# EAGLE design lednode2 (EAGLE 6.5.0)
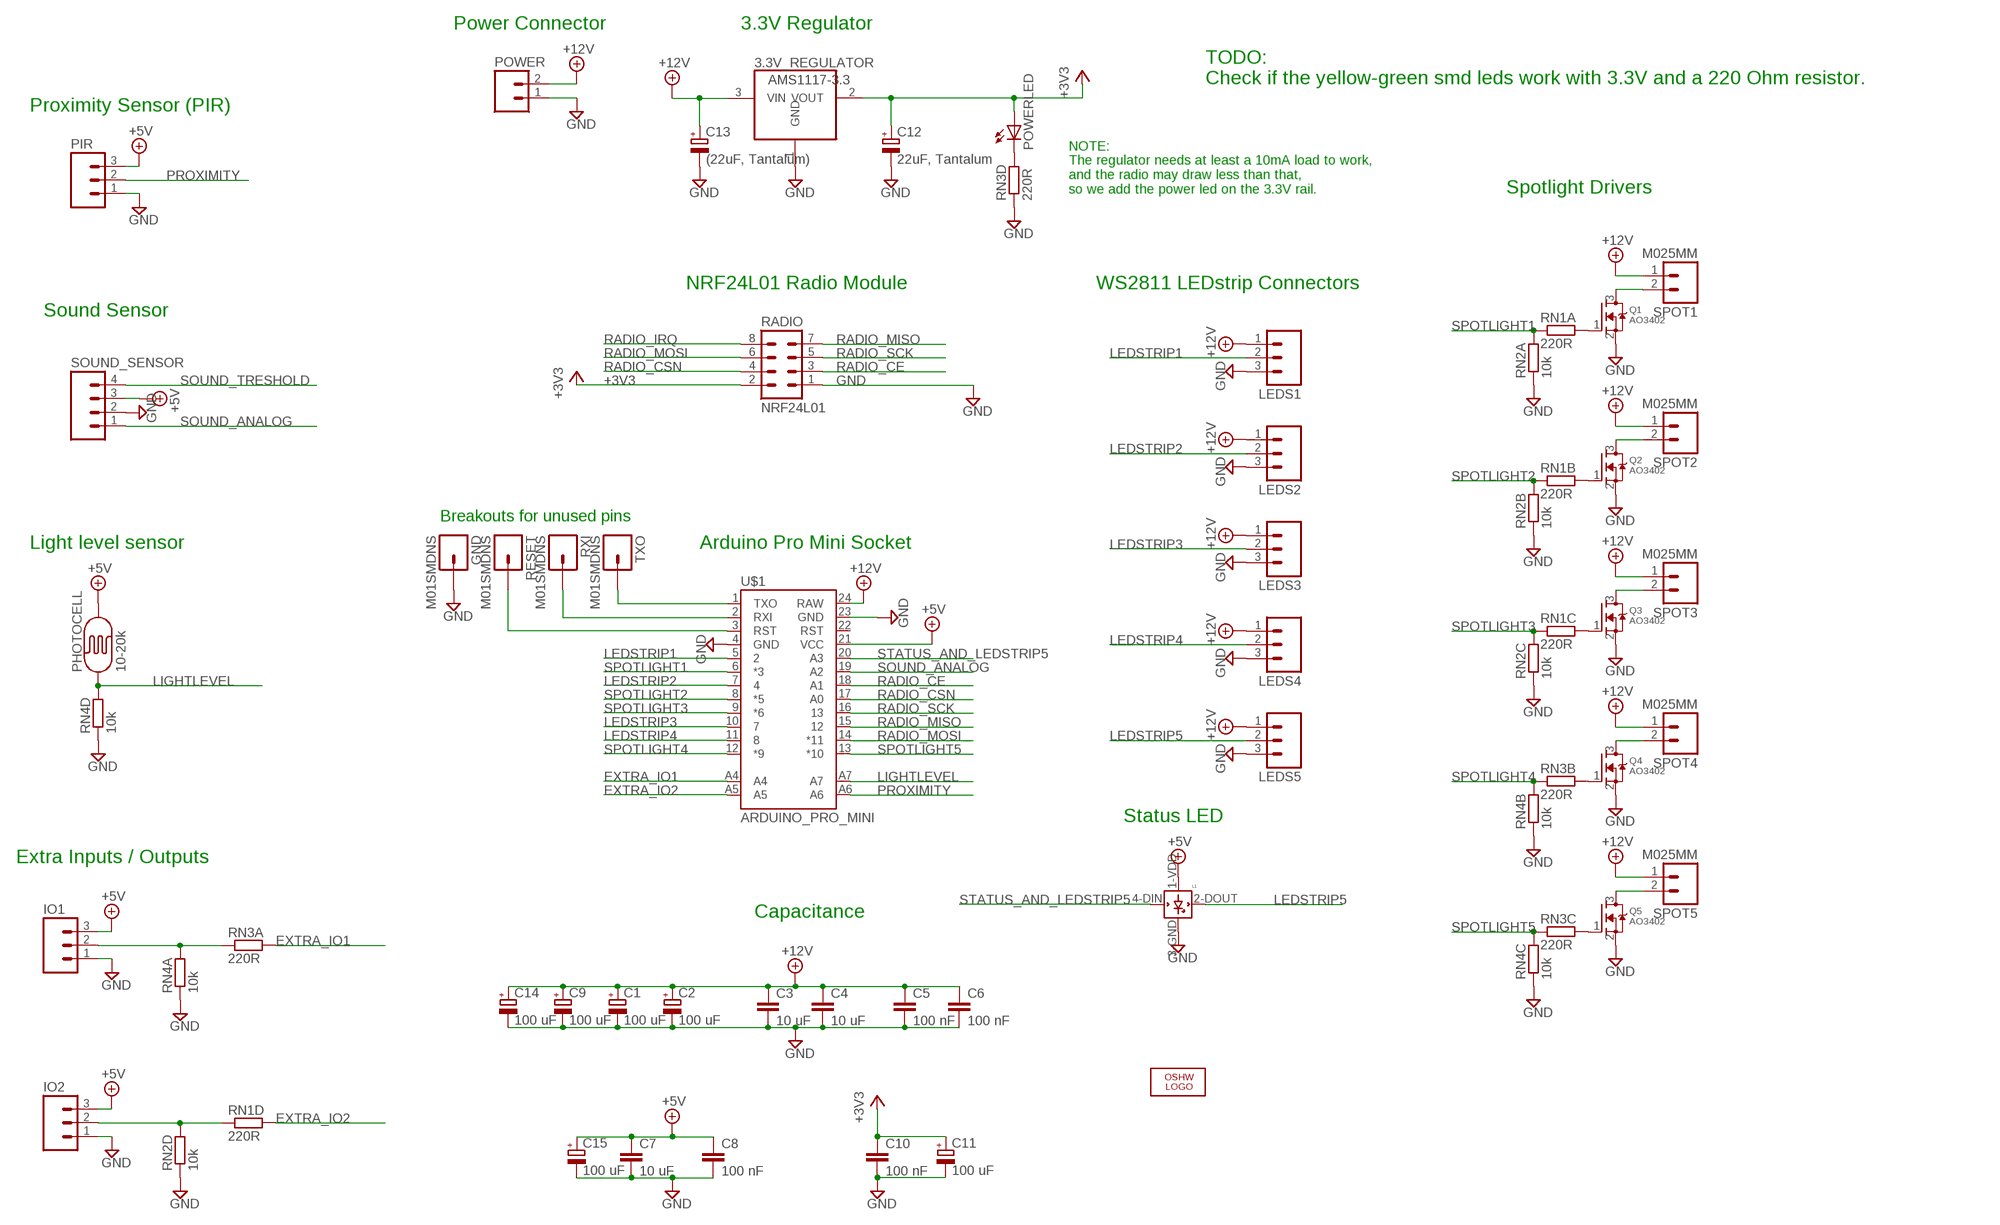
[diagram p0: schematic, sheet 1]

## Parts
3.3V_REGULATOR  AMS1117-3.3  REG1117  [SOT223]
C1  100 uF  CPOL-EUE2.5-6  [E2,5-6]
C2  100 uF  CPOL-EUE2.5-6  [E2,5-6]
C3  10 uF  C-EUC1206  [C1206]
C4  10 uF  C-EUC1206  [C1206]
C5  100 nF  C-EUC0805  [C0805]
C6  100 nF  C-EUC0805  [C0805]
C7  10 uF  C-EUC1206  [C1206]
C8  100 nF  C-EUC0805  [C0805]
C9  100 uF  CPOL-EUE2.5-6  [E2,5-6]
C10  100 nF  C-EUC0805  [C0805]
C11  100 uF  CPOL-EUE2.5-6  [E2,5-6]
C12  22uF, Tantalum  CPOL-EUSMCA  [SMC_A]
C13  (22uF, Tantalum)  CPOL-EUSMCA  [SMC_A]
C14  100 uF  CPOL-EUE2.5-6  [E2,5-6]
C15  100 uF  CPOL-EUE2.5-6  [E2,5-6]
GND  M01SMDNS  [1X01NS]
IO1  M03PTH  [1X03]
IO2  M03PTH  [1X03]
L1  WS2812B  [WS2812B]
LEDS1  M03LONGPADS  [1X03_LONGPADS]
LEDS2  M03LONGPADS  [1X03_LONGPADS]
LEDS3  M03LONGPADS  [1X03_LONGPADS]
LEDS4  M03LONGPADS  [1X03_LONGPADS]
LEDS5  M03LONGPADS  [1X03_LONGPADS]
LOGO3  LOGO-OSHW-8MILX0100-NT  [OSHW_8X100_NOTEXT]
PHOTOCELL  10-20k  PHOTOCELLPTH  [PHOTOCELL]
PIR  M03PTH  [1X03]
POWER  M025MM  [SCREWTERMINAL-5MM-2]
POWERLED  LEDSMT1206  [1206]
Q1  AO3402  MOSFET-NWAVE  [SOT23-W]
Q2  AO3402  MOSFET-NWAVE  [SOT23-W]
Q3  AO3402  MOSFET-NWAVE  [SOT23-W]
Q4  AO3402  MOSFET-NWAVE  [SOT23-W]
Q5  AO3402  MOSFET-NWAVE  [SOT23-W]
RADIO  NRF24L01  MA04-2  [MA04-2]
RESET  M01SMDNS  [1X01NS]
RN1  220R  RESISTOR_ARRAY_4  [RN8P-4R-CRA06S]
RN2  10k  RESISTOR_ARRAY_4  [RN8P-4R-CRA06S]
RN3  220R  RESISTOR_ARRAY_4  [RN8P-4R-CRA06S]
RN4  10k  RESISTOR_ARRAY_4  [RN8P-4R-CRA06S]
RXI  M01SMDNS  [1X01NS]
SOUND_SENSOR  M041X04_NO_SILK  [1X04_NO_SILK]
SPOT1  M025MM  [SCREWTERMINAL-5MM-2]
SPOT2  M025MM  [SCREWTERMINAL-5MM-2]
SPOT3  M025MM  [SCREWTERMINAL-5MM-2]
SPOT4  M025MM  [SCREWTERMINAL-5MM-2]
SPOT5  M025MM  [SCREWTERMINAL-5MM-2]
TXO  M01SMDNS  [1X01NS]
U$1  ARDUINO_PRO_MINI  [ARDUINO_PRO_MINI]

## Nets
+3V3: 3.3V_REGULATOR.2(VOUT) C10.1 C11.+ C12.+ POWERLED.A RADIO.2
+5V: C7.1 C8.1 C15.+ IO1.3 IO2.3 L1.1-VDD(VDD) PHOTOCELL.2 PIR.3 SOUND_SENSOR.3 U$1.21(VCC)
+12V: 3.3V_REGULATOR.3(VIN) C1.+ C2.+ C3.1 C4.1 C5.1 C6.1 C9.+ C13.+ C14.+ LEDS1.1 LEDS2.1 LEDS3.1 LEDS4.1 LEDS5.1 POWER.2 SPOT1.1 SPOT2.1 SPOT3.1 SPOT4.1 SPOT5.1 U$1.24(RAW)
EXTRA_IO1: RN3.8 U$1.A4
EXTRA_IO2: RN1.5 U$1.A5
GND: 3.3V_REGULATOR.1(GND) C1.- C2.- C3.2 C4.2 C5.2 C6.2 C7.2 C8.2 C9.- C10.2 C11.- C12.- C13.- C14.- C15.- GND.1 IO1.1 IO2.1 L1.3-GND(GND) LEDS1.3 LEDS2.3 LEDS3.3 LEDS4.3 LEDS5.3 PIR.1 POWER.1 Q1.2(S) Q2.2(S) Q3.2(S) Q4.2(S) Q5.2(S) RADIO.1 RN2.1 RN2.2 RN2.3 RN2.4 RN3.4 RN4.1 RN4.2 RN4.3 RN4.4 SOUND_SENSOR.2 U$1.4(GND) U$1.23(GND)
LEDSTRIP1: LEDS1.2 U$1.5
LEDSTRIP2: LEDS2.2 U$1.7
LEDSTRIP3: LEDS3.2 U$1.10
LEDSTRIP4: LEDS4.2 U$1.11
LEDSTRIP5: L1.2-DOUT(DOUT) LEDS5.2
LIGHTLEVEL: PHOTOCELL.1 RN4.5 U$1.A7
N$1: Q5.3(D) SPOT5.2
N$2: Q1.3(D) SPOT1.2
N$3: Q2.3(D) SPOT2.2
N$4: Q4.3(D) SPOT4.2
N$5: Q3.3(D) SPOT3.2
N$6: Q1.1(G) RN1.8
N$7: Q2.1(G) RN1.7
N$8: Q4.1(G) RN3.7
N$9: Q3.1(G) RN1.6
N$10: Q5.1(G) RN3.6
N$11: POWERLED.C RN3.5
N$13: IO2.2 RN1.4 RN2.5
N$14: TXO.1 U$1.1(TXO)
N$15: RXI.1 U$1.2(RXI)
N$16: RESET.1 U$1.3(RST)
PROXIMITY: PIR.2 U$1.A6
RADIO_CE: RADIO.3 U$1.18(A1)
RADIO_CSN: RADIO.4 U$1.17(A0)
RADIO_IRQ: RADIO.8
RADIO_MISO: RADIO.7 U$1.15
RADIO_MOSI: RADIO.6 U$1.14(*11)
RADIO_SCK: RADIO.5 U$1.16
SENSOR1: IO1.2 RN3.1 RN4.8
SOUND_ANALOG: SOUND_SENSOR.1 U$1.19(A2)
SOUND_TRESHOLD: SOUND_SENSOR.4
SPOTLIGHT1: RN1.1 RN2.8 U$1.6(*3)
SPOTLIGHT2: RN1.2 RN2.7 U$1.8(*5)
SPOTLIGHT3: RN1.3 RN2.6 U$1.9(*6)
SPOTLIGHT4: RN3.2 RN4.7 U$1.12(*9)
SPOTLIGHT5: RN3.3 RN4.6 U$1.13(*10)
STATUS_AND_LEDSTRIP5: L1.4-DIN(DIN) U$1.20(A3)
Unconnected: U$1.22(RST)

## Notes on the sheet
- Power Connector | 3.3V Regulator
- TODO:
  Check if the yellow-green smd leds work with 3.3V and a 220 Ohm resistor.
- Proximity Sensor (PIR)
- NOTE:
  The regulator needs at least a 10mA load to work, 
  and the radio may draw less than that, 
  so we add the power led on the 3.3V rail.
- Spotlight Drivers
- NRF24L01 Radio Module | WS2811 LEDstrip Connectors
- Sound Sensor
- Breakouts for unused pins
- Light level sensor | Arduino Pro Mini Socket
- Status LED
- Extra Inputs / Outputs
- Capacitance

## Library data of the parts
3.3V_REGULATOR = burr-brown:REG1117: 800mA and 1A Low Dropout (LDO) Positive Regulator 1.8V, 2.5V, 2.85V, 3.3V, 5V, and Adj; MPN: REG1117; OC_FARNELL: 1097566; OC_NEWARK: 14P6981
C1 C2 C9 C11-C15 = rcl:CPOL-EU: POLARIZED CAPACITOR, European symbol
C3-C8 C10 = rcl:C-EU: CAPACITOR, European symbol
GND RESET RXI TXO = SparkFun-Connectors:M01: Header 1 Standard 1-pin 0.1" header. Use with straight break away headers (SKU : PRT-00116), right angle break away headers (PRT-00553), swiss pins (PRT-00743), machine pins (PRT-00117), and female headers (PRT-00115).
IO1 IO2 LEDS1-LEDS5 PIR = SparkFun-Connectors:M03: Header 3 Standard 3-pin 0.1" header. Use with straight break away headers (SKU : PRT-00116), right angle break away headers (PRT-00553), swiss pins (PRT-00743), machine pins (PRT-00117), and female headers (PRT-00115). Molex polarized connector foot print use with SKU : PRT-08232 with associated crimp pins and housings.
L1 = adafruit:WS2812B
LOGO3 = Logo:LOGO-OSHW-8MIL
PHOTOCELL = SparkFun-Sensors:PHOTOCELL: CdS photoresistor. This is a low cost way to detect light levels. Resistance decreases with more incoming light. SparkFun SKU: SEN-09088
POWER = SparkFun:M02: Header 2 Standard 2-pin 0.1" header. Use with straight break away headers (SKU : PRT-00116), right angle break away headers (PRT-00553), swiss pins (PRT-00743), machine pins (PRT-00117), and female headers (PRT-00115). Molex polarized connector foot print use with SKU : PRT-08233 with associated crimp pins and housings.
POWERLED = led:LED: LED OSRAM: - CHIPLED LG R971, LG N971, LY N971, LG Q971, LY Q971, LO R971, LY R971 LH N974, LH R974 LS Q976, LO Q976, LY Q976 LO Q996 - Hyper CHIPLED LW Q18S LB Q993, LB Q99A, LB R99A - SideLED LS A670, LO A670, LY A670, LG A670, LP A670 LB A673, LV A673, LT A673, LW A673 LH A674 LY A675 LS A676, LA A676, LO A676, LY A676, LW A676 LS A679, LY A679, LG A679 - Hyper Micro SIDELED® LS Y876, LA Y876, LO Y876, LY Y876 LT Y87S - SmartLED LW L88C, LW L88S LB L89C, LB L89S, LG L890 LS L89K, LO L89K, LY L89K LS L896, LA L896, LO L896, LY L896 - TOPLED LS T670, LO T670, LY T670, LG T670, LP T670 LSG T670, LSP T670, LSY T670, LOP T670, LYG T670 LG T671, LOG T671, LSG T671 LB T673, LV T673, LT T673, LW T673 LH T674 LS T676, LA T676, LO T676, LY T676, LB T676, LH T676, LSB T676, LW T676 LB T67C, LV T67C, LT T67C, LS T67K, LO T67K, LY T67K, LW E67C LS E67B, LA E67B, LO E67B, LY E67B, LB E67C, LV E67C, LT E67C LW T67C LS T679, LY T679, LG T679 LS T770, LO T770, LY T770, LG T770, LP T770 LB T773, LV T773, LT T773, LW T773 LH T774 LS E675, LA E675, LY E675, LS T675 LS T776, LA T776, LO T776, LY T776, LB T776 LHGB T686 LT T68C, LB T68C - Hyper Mini TOPLED® LB M676 - Mini TOPLED Santana® LG M470 LS M47K, LO M47K, LY M47K Source: http://www.osram.convergy.de LUXEON: - LUMILED® LXK2-PW12-R00, LXK2-PW12-S00, LXK2-PW14-U00, LXK2-PW14-V00 LXK2-PM12-R00, LXK2-PM12-S00, LXK2-PM14-U00 LXK2-PE12-Q00, LXK2-PE12-R00, LXK2-PE12-S00, LXK2-PE14-T00, LXK2-PE14-U00 LXK2-PB12-K00, LXK2-PB12-L00, LXK2-PB12-M00, LXK2-PB14-N00, LXK2-PB14-P00, LXK2-PB14-Q00 LXK2-PR12-L00, LXK2-PR12-M00, LXK2-PR14-Q00, LXK2-PR14-R00 LXK2-PD12-Q00, LXK2-PD12-R00, LXK2-PD12-S00 LXK2-PH12-R00, LXK2-PH12-S00 LXK2-PL12-P00, LXK2-PL12-Q00, LXK2-PL12-R00 Source: www.luxeon.com KINGBRIGHT: KA-3528ASYC Source: www.kingbright.com
Q1-Q5 = adafruit:MOSFET-N: N-Channel Mosfet 2N7002E - 60V 260mA SOT23 [Digikey: 2N7002ET1GOSTR-ND] - REEL BSH103 - 30V 850mA SOT23 [Digikey: 568-5013-1-ND]
RADIO = con-lstb:MA04-2: PIN HEADER; OC_FARNELL: unknown; OC_NEWARK: unknown
RN1-RN4 = dp_devices:RESISTOR_ARRAY_4: 4 Resistor Array 0603
SOUND_SENSOR = SparkFun-Connectors:M04: Header 4 Standard 4-pin 0.1" header. Use with straight break away headers (SKU : PRT-00116), right angle break away headers (PRT-00553), swiss pins (PRT-00743), machine pins (PRT-00117), and female headers (PRT-00115). Molex polarized connector foot print use with SKU : PRT-08231 with associated crimp pins and housings. 1MM SMD Version SKU: PRT-10208
SPOT1-SPOT5 = SparkFun-Connectors:M02: Standard 2-pin 0.1" header. Use with - straight break away headers ( PRT-00116) - right angle break away headers (PRT-00553) - swiss pins (PRT-00743) - machine pins (PRT-00117) - female headers (PRT-00115) Molex polarized connector foot print use with: PRT-08233 with associated crimp pins and housings. 2.54_SCREWTERM for use with PRT-10571. 3.5mm Screw Terminal footprints for PRT-08084 5mm Screw Terminal footprints for use with PRT-08433
U$1 = SparkFun-Boards-with-arduino-pro-mini-without-connection-pins:ARDUINO_PRO_MINI

## Board
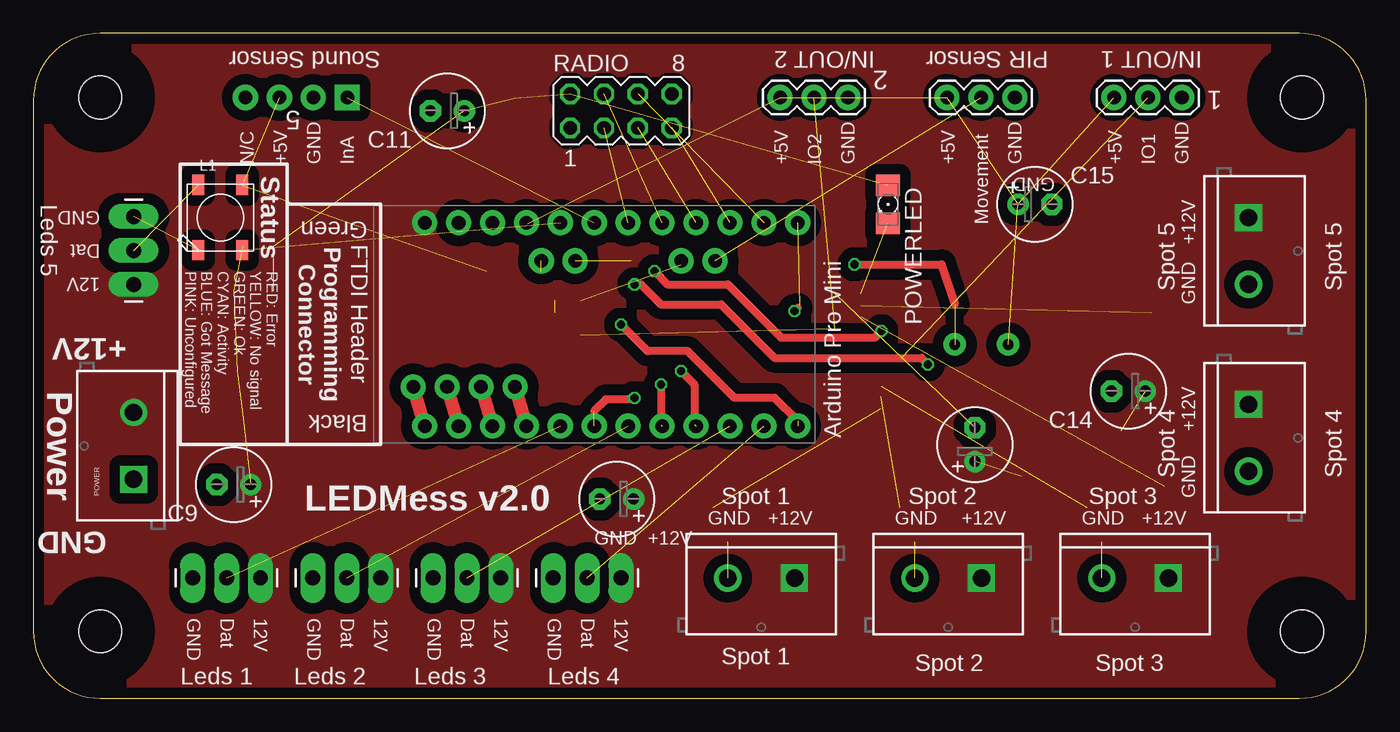
[diagram p1: board, top side]
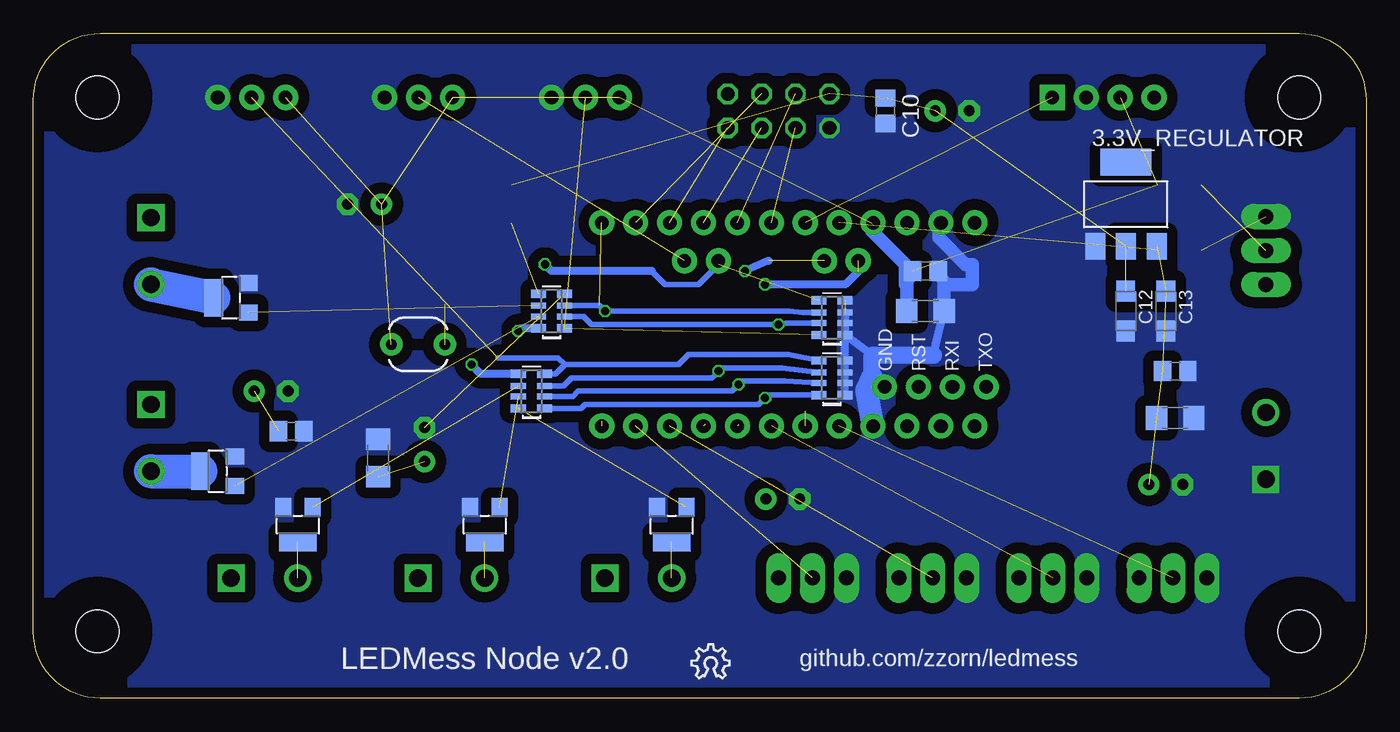
[diagram p2: board, bottom side, seen from below]

Size 99.8 x 49.8 mm. Coordinates in mm from the lower left corner, seen from the top.
Outline: 0,44.8 0,5 arc90 5,0 94.8,0 arc90 99.8,5 99.8,44.8 arc90 94.8,49.8 5,49.8 arc90 0,44.8
Copper layers (1*16): Top 0.035mm / dielectric 1.5mm / Bottom 0.035mm
Design rules "SeeedStudio_2layer_DRU_no_angle_20140221": minimum track width 6mil, minimum drill 12mil, track to track 6mil, track to pad 6mil, pad to pad 6mil, via to via 6mil, smd to smd 0mil, copper to edge 10mil, drill to drill 10mil, minimum pad ring 10mil, minimum via ring 6mil, stop-mask expansion 2mil, vias tented up to drill 100mil, thermal gap 10mil
Holes 3.2 mm at 95,5 95,45 5,45 5,5
tRestrict: area 3,3 to 7,7; area 93,3 to 97,7; area 93,43 to 97,47; area 3,43 to 7,47
bRestrict: area 3,3 to 7,7; area 93,3 to 97,7; area 93,43 to 97,47; area 3,43 to 7,47

### Footprints (pad centres in the part's own frame; a part is rotated, then mirrored left to right if it is on the bottom)
SOT223 = smd 1.499 x 2.007: 1 -2.261,-3.15; 2 0.025,-3.15; 3 2.311,-3.15 | smd 3.81 x 2.007: 4 0,3.15
E2,5-6 = drill 0.813 pad 1.6: + -1.27,0 | drill 0.813 pad 1.6 octagon: - 1.27,0
C1206 = smd 1.6 x 1.8: 1 -1.4,0; 2 1.4,0
C0805 = smd 1.3 x 1.5: 1 -0.95,0; 2 0.95,0
SMC_A = smd 1.6 x 1.4: + -1.5,0; - 1.5,0
1X01NS = drill 1.016 pad 1.88: 1 0,0
1X03 = drill 1.016 pad 1.88: 1 0,0; 2 2.54,0; 3 5.08,0
WS2812B = smd 1.5 x 0.9: 1-VDD 2.45,-1.65; 2-DOUT 2.45,1.65; 3-GND -2.45,1.65; 4-DIN -2.45,-1.65
1X03_LONGPADS = drill 1.118 pad 1.88 long: 1 0,0; 2 2.54,0; 3 5.08,0
PHOTOCELL = drill 0.8 pad 1.676: 1 -2,0; 2 2,0
SCREWTERMINAL-5MM-2 = drill 1.3 pad 2.032 square: 1 0,0 | drill 1.3 pad 2.032: 2 5,0
1206 = smd 1.6 x 1.803: A -1.422,0; C 1.422,0
SOT23-W = smd 1.2 x 1.4: 1 -1.1,-1.3; 2 1.1,-1.3 | smd 2.8 x 1.4: 3 0,1.3
MA04-2 = drill 1.016 octagon: 1 -3.81,-1.27; 2 -3.81,1.27; 3 -1.27,-1.27; 4 -1.27,1.27; 5 1.27,-1.27; 6 1.27,1.27; 7 3.81,-1.27; 8 3.81,1.27
RN8P-4R-CRA06S = smd 0.63 x 1.15: 1 -1.295,-0.975; 4 1.295,-0.975; 5 1.295,0.975; 8 -1.295,0.975 | smd 0.44 x 1.15: 2 -0.4,-0.975; 3 0.4,-0.975; 6 0.4,0.975; 7 -0.4,0.975
1X04_NO_SILK = drill 1.016 pad 1.88 square: 1 0,0 | drill 1.016 pad 1.88: 2 2.54,0; 3 5.08,0; 4 7.62,0
ARDUINO_PRO_MINI = drill 1.016 pad 1.88: 1 -7.62,12.7; 2 -7.62,10.16; 3 -7.62,7.62; 4 -7.62,5.08; 5 -7.62,2.54; 6 -7.62,0; 7 -7.62,-2.54; 8 -7.62,-5.08; 9 -7.62,-7.62; 10 -7.62,-10.16; 11 -7.62,-12.7; 12 -7.62,-15.24; 13 7.62,-15.24; 14 7.62,-12.7; 15 7.62,-10.16; 16 7.62,-7.62; 17 7.62,-5.08; 18 7.62,-2.54; 19 7.62,0; 20 7.62,2.54; 21 7.62,5.08; 22 7.62,7.62; 23 7.62,10.16; 24 7.62,12.7; A4 4.763,1.429; A5 4.763,3.969; A6 4.763,-9.049; A7 4.763,-6.509

### Placement (x,y rotation side)
3.3V_REGULATOR  18,37 0 bottom
C1  70.5,19 90 top
C2  43.68,14.92 180 top
C3  14.3,21 0 bottom
C4  74,18 90 bottom
C5  14.3,24.5 0 bottom
C6  80.5,20 0 bottom
C7  33,29 0 bottom
C8  33,32 0 bottom
C9  15,16 180 top
C10  36,44 270 bottom
C11  31,44 180 top
C12  18,29 270 bottom
C13  15,29 270 bottom
C14  82,23 180 top
C15  75,37 0 top
GND  36.06,23.32 0 top
IO1  61,45 180 top
IO2  86,45 180 top
L1  14,36 90 top
LEDS1  17,9 180 top
LEDS2  26,9 180 top
LEDS3  35,9 180 top
LEDS4  44,9 180 top
LEDS5  7.5,31 90 top
LOGO3  50.5,1.5 0 bottom
PHOTOCELL  71,26.5 180 bottom
PIR  73.5,45 180 top
POWER  7.5,16.4 90 top
POWERLED  64,37 270 top
Q1  52,13 180 bottom
Q2  66,13 180 bottom
Q3  80,13 180 bottom
Q4  86,17 90 bottom
Q5  85,30 90 bottom
RADIO  44,44 0 top
RESET  33.52,23.32 0 top
RN1  62.5,23 90 bottom
RN2  40,24 90 bottom
RN3  61,29 90 bottom
RN4  40,28.5 90 bottom
RXI  30.98,23.32 0 top
SOUND_SENSOR  23.5,45 180 top
SPOT1  57,9 180 top
SPOT2  71,9 180 top
SPOT3  85,9 180 top
SPOT4  91,22 270 top
SPOT5  91,36 270 top
TXO  28.44,23.32 0 top
U$1  42,28 90 top

### Tracks (layer width: path | path; a pad name or v marks a point on that pad's centre or on a via)
+3V3  (5 unrouted)
+5V  (7 unrouted)
  Bottom 1.016: U$1.21 37,35.54 37,35 34.5,32.5 34.5,31 C8.1 34.4,32.05 C7.1
+12V  (6 unrouted)
  pour Top (isolate 0.813, no thermals): 0,50 100,50 100,0 0,0
EXTRA_IO1  (via drill 0.6)  (1 unrouted)
  Top 0.61: v63.5,27.5 63,27 56,27 52,31 47.5,31 v46.5,32
  Bottom 0.406: 63.3,27.7 v63.5,27.5
  Bottom 0.61: RN3.8 63.3,27.7 | 44.74,32.76 v46.5,32
EXTRA_IO2  (via drill 0.6)  (1 unrouted)
  Top 0.61: v67,25 66.5,25.5 55.5,25.5 51.5,29.5 47,29.5 45.5,31 v45,31
  Bottom 0.61: RN1.5 66.3,24.3 v67,25 | 38.03,31.97 39,31 v45,31
GND  (3 unrouted)
  Top 1.016: GND.1 U$1.4
  Bottom 0.61: RN4.3 RN4.2 RN4.1 | RN2.1 RN2.2 RN2.3 RN2.4 RN4.1 | RN4.1 37,25.7 | 32.4,25.7 C7.2
  Bottom 1.016: C8.2 31.5,31 | 31.5,31 29.5,31 29.5,32.5 30,32.5 32,34.5 32,35.46 U$1.23 | C7.2 31.6,30.9 31.5,31
  Bottom 1.27: 32.4,25.7 37,25.7 37,24
  Bottom 1.676: U$1.4 37.42,23.08 37,24
  pour Bottom (isolate 0.813, no thermals): 0,50 100,50 100,0 0,0
LEDSTRIP1  (1 unrouted)
LEDSTRIP2  (1 unrouted)
LEDSTRIP3  (1 unrouted)
LEDSTRIP4  (1 unrouted)
LEDSTRIP5  (1 unrouted)
LIGHTLEVEL  (via drill 0.6)  (2 unrouted)
  Top 0.61: v61.5,32.5 68,32.5 69,29.5
  Bottom 0.406: U$1.A7 48.51,32.49 50,31 52.5,31 53.5,32
  Bottom 0.61: 53.5,32 61,32 v61.5,32.5
N$1
  Bottom 2.54: SPOT5.2 Q5.3
N$2  (1 unrouted)
N$3  (1 unrouted)
N$4
  Bottom 2.54: SPOT4.2 Q4.3
N$5  (1 unrouted)
N$6  (1 unrouted)
N$7  (1 unrouted)
N$8  (1 unrouted)
N$9  (1 unrouted)
N$10  (1 unrouted)
N$11  (1 unrouted)
N$13  (1 unrouted)
  Bottom 0.406: RN1.4 60.7,24.3 60,25 | 60,25 51.5,25 50.75,25.75 43.25,25.75 RN2.5 | 65,25.5 60.5,25.5 60,25
N$14
  Top 1.016: U$1.1 TXO.1
N$15
  Top 1.016: U$1.2 RXI.1
N$16
  Top 1.016: RESET.1 U$1.3
PROXIMITY  (1 unrouted)
RADIO_CE  (1 unrouted)
RADIO_CSN  (1 unrouted)
RADIO_MISO  (1 unrouted)
RADIO_MOSI  (1 unrouted)
RADIO_SCK  (1 unrouted)
SENSOR1  (2 unrouted)
SOUND_ANALOG  (1 unrouted)
SPOTLIGHT1  (via drill 0.6)  (1 unrouted)
  Top 0.406: v45,22.5 45,22.38
  Top 0.61: 45,22.38 42.88,22.38 42,21.5
  Bottom 0.406: RN2.8 44.8,22.7 v45,22.5 45.5,22 58.5,22 58.8,21.7 RN1.1
SPOTLIGHT2  (via drill 0.6)  (1 unrouted)
  Top 0.61: v47,23.5 47,20.46
  Bottom 0.406: RN2.7 43.5,23.75 46.75,23.75 v47,23.5 47.5,23 59,23 59.4,22.6 RN1.2
SPOTLIGHT3  (via drill 0.6)  (1 unrouted)
  Top 0.61: v48.5,24.5 49.5,23.5 49.5,20.5
  Bottom 0.406: RN2.6 43.75,24.75 48.25,24.75 v48.5,24.5 49,24 59.5,24 60.1,23.4 RN1.3
SPOTLIGHT4  (via drill 0.6)  (1 unrouted)
  Top 0.61: 57.24,20.76 55.5,22.5 52.5,22.5 49,26 46,26 v44,28
  Bottom 0.406: RN4.7 43.4,28.1 v44,28 58,28 58.6,28.6 RN3.2
SPOTLIGHT5  (via drill 0.6)  (1 unrouted)
  Top 0.61: 57.24,29.24 v57,29
  Bottom 0.406: RN3.3 57.4,29.4 v57,29 43.25,29 42.15,28.9 RN4.6
STATUS_AND_LEDSTRIP5  (1 unrouted)

### Text on the board
tSilk: Sound Sensor | IN/OUT 2 | PIR Sensor | IN/OUT 1 | 2 | 1 | 5 | N/C | +5V | GND | InA | +5V | IO2 | GND | +5V | GND | +5V | IO1 | GND | GND | Leds 5 | GND | Status | Green | Movement | Dat | FTDI Header | +12V | 12V | RED: Error / YELLOW: No signal / GREEN: Ok / CYAN: Activity / BLUE: Got Message / PINK: Unconfigured | Spot 5 | GND | Spot 5 | +12V | Power | Black | Arduino Pro Mini | +12V | Spot 4 | Spot 4 | LEDMess v2.0 | GND | Spot 1 | Spot 2 | Spot 3 | GND | +12V | GND | +12V | GND | +12V | GND | GND | +12V | GND | Dat | 12V | GND | Dat | 12V | GND | Dat | 12V | GND | Dat | 12V | Spot 1 | Spot 2 | Spot 3 | Leds 1 | Leds 2 | Leds 3 | Leds 4
_tsilk: TODO: Check size of / * Sound sensor module / * Radio module / * PIR module / / And make sure they can be mounted at the same time (on top?). | Programming / Connector
_bsilk: TXO | RXI | RST | GND | github.com/zzorn/ledmess | LEDMess Node v2.0